# Altium schematic sheet CH340G.SchDoc
size A
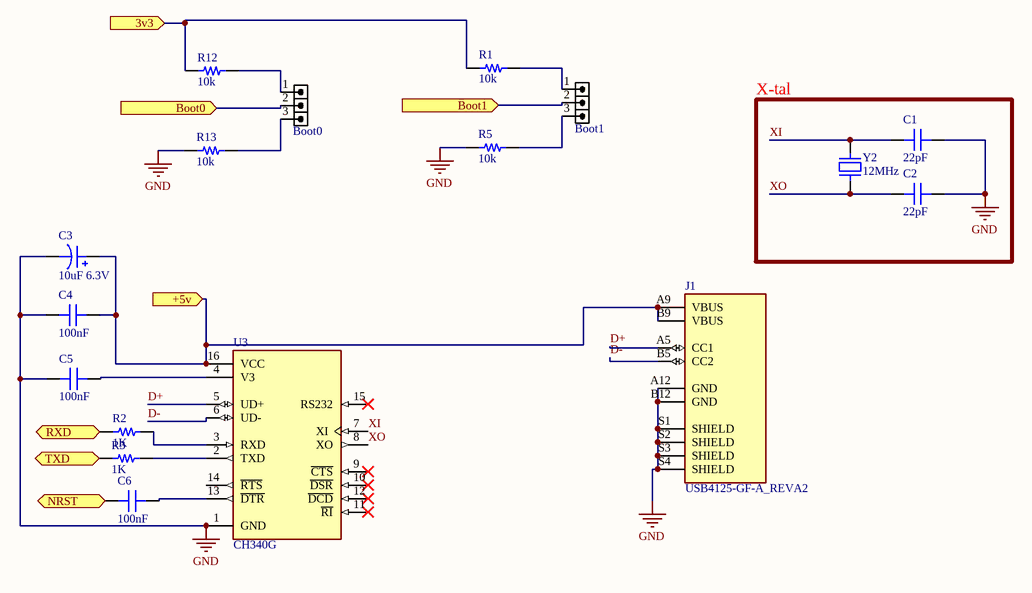
[diagram p0: CH340G.SchDoc]

## Parts
Boot0  HDRM3  [HDR_1X3]  (value not drawn)
Boot1  HDRM3  [HDR_1X3]  (value not drawn)
C1  22pF  [CAP 0805_2012]
C2  22pF  [CAP 0805_2012]
C3  10uF 6.3V  [CAP ALTH D8 L3.5 H12.5]
C4  100nF  [CAP 0805_2012]
C5  100nF  [CAP 0805_2012]
C6  100nF  [CAP 0805_2012]
J1  USB4125-GF-A_REVA2  [GCT_USB4125-GF-A_REVA2]
R1  10k  [RES 0805_2012]
R2  1K  [RES 0805_2012]
R3  1K  [RES 0805_2012]
R5  10k  [RES 0805_2012]
R12  10k  [RES 0805_2012]
R13  10k  [RES 0805_2012]
U3  CH340G  [SOIC127P600X180-16N]
Y2  12MHz  [HC-49S SMD]

## Blocks framed on the sheet
X-tal: C1 C2 Y2

## Ports
3v3 (in), +5v (in), Boot0 (in), Boot1 (in), NRST (bidir), RXD (bidir), TXD (bidir)

## Nets
GND: C1.2 C2.2 C3.2 C4.2 C5.1 J1.A12(GND) J1.B12(GND) J1.S1(SHIELD) J1.S2(SHIELD) J1.S3(SHIELD) J1.S4(SHIELD) R5.1 R13.1 U3.1(GND)
3v3: R1.1 R12.1 ; port 3v3
+5v: C3.1 C4.1 J1.A9(VBUS) J1.B9(VBUS) U3.16(VCC) ; port +5v
Boot0: Boot0.2 ; port Boot0
Boot1: Boot1.2 ; port Boot1
D+: J1.A5(CC1) U3.5(UD+)
D-: J1.B5(CC2) U3.6(UD-)
NRST: C6.1 ; port NRST
RXD: R2.1 ; port RXD
TXD: R3.1 ; port TXD
XI: C1.1 U3.7(XI) Y2.2
XO: C2.1 U3.8(XO) Y2.1
NetBoot0_1: Boot0.1 R12.2
NetBoot0_3: Boot0.3 R13.2
NetBoot1_1: Boot1.1 R1.2
NetBoot1_3: Boot1.3 R5.2
NetC5_2: C5.2 U3.4(V3)
NetC6_2: C6.2 U3.13(~{DTR})
NetR2_2: R2.2 U3.3(RXD)
NetR3_2: R3.2 U3.2(TXD)

Not connected (* = marked no-connect by the designer): U3 9(~{CTS})* 10(~{DSR})* 11(~{RI})* 12(~{DCD})* 14(~{RTS}) 15(RS232)*

## Library data of the parts
Boot0 Boot1 = HDR_1X3: CONN, HEADER, Male, pitch: 2.54mm, 3POS; VALUE: HDRM3
C1 C2 = Cap 0805: SMT Capacitor; VALUE: 100nF
C3 = Cap Alu TH D8mm L3.5mm H12.5mm: TH Aluminum Polymer Capacitor; VALUE: 10uF 6.3V
C4-C6 = Cap 0805: SMT Capacitor; VALUE: 100nF
R1 R5 R12 R13 = Res 0805: SMT Resistor; VALUE: 1K
R2 R3 = Res 0805: SMT Resistor; VALUE: 1K
U3 = CH340G: USB Interface Integrated Circuit; MF: WCH; Value: *; SnapEDA_Link: https://www.snapeda.com/parts/Ch340G/WCH/view-part/?ref=snap; MP: Ch340G; Check_prices: https://www.snapeda.com/parts/Ch340G/WCH/view-part/?ref=eda; Availability: Not in stock; Price: None; Package: None
Y2 = Crystal HC-49S SMD 8MHz: SMT Crystal; PartNumber: ABLS-8.000MHZ-K4T
J1 = USB4125-GF-A_REVA2: Package: None; Availability: Unavailable; MP: USB4125-GF-A_REVA2; Value: *; Price: None